# EAGLE design fonte-ajustavel (EAGLE 9.6.2)
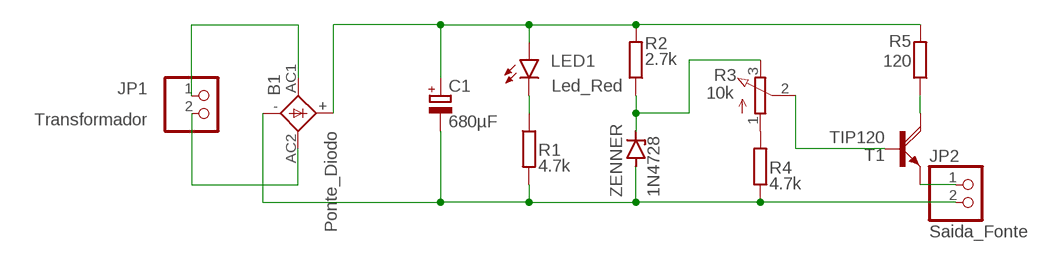
[diagram p0: schematic, sheet 1]

## Parts
B1  Ponte_Diodo  1KAB  [1KAB]
C1  680µF  CPOL-EUE5-10.5  [E5-10,5]
JP1  Transformador  PINHD-1X2  [1X02]
JP2  Saida_Fonte  PINHD-1X2  [1X02]
LED1  Led_Red  LED5MM  [LED5MM]
R1  4.7k  R-EU_0204/7  [0204/7]
R2  2.7k  R-EU_0204/7  [0204/7]
R3  10k  3RP/1610N  [3RP/1610N]
R4  4.7k  R-EU_0204/7  [0204/7]
R5  120  R-EU_0204/7  [0204/7]
T1  TIP120  [TO220AH]
ZENNER  1N4728  [DO41Z10]

## Nets
N$1: B1.AC1 JP1.1
N$2: B1.- C1.- JP2.2 R1.2 R4.1 ZENNER.A
N$3: B1.AC2 JP1.2
N$5: R3.1(A) R4.2
N$6: LED1.K(C) R1.1
N$7: R2.1 R3.3(E) ZENNER.C
N$8: JP2.1 T1.E
N$9: R5.1 T1.C
N$10: R3.2(S) T1.B
N$12: B1.+ C1.+ LED1.A R2.2 R5.2

## Library data of the parts
B1 = rectifier:1KAB: RECTIFIER grid 5,08 x 5,08 mm
C1 = rcl:CPOL-EU: POLARIZED CAPACITOR, European symbol; SPICEPREFIX: C
JP1 JP2 = pinhead:PINHD-1X2: PIN HEADER
LED1 = led:LED: LED OSRAM: - CHIPLED LG R971, LG N971, LY N971, LG Q971, LY Q971, LO R971, LY R971 LH N974, LH R974 LS Q976, LO Q976, LY Q976 LO Q996 - Hyper CHIPLED LW Q18S LB Q993, LB Q99A, LB R99A - SideLED LS A670, LO A670, LY A670, LG A670, LP A670 LB A673, LV A673, LT A673, LW A673 LH A674 LY A675 LS A676, LA A676, LO A676, LY A676, LW A676 LS A679, LY A679, LG A679 - Hyper Micro SIDELED® LS Y876, LA Y876, LO Y876, LY Y876 LT Y87S - SmartLED LW L88C, LW L88S LB L89C, LB L89S, LG L890 LS L89K, LO L89K, LY L89K LS L896, LA L896, LO L896, LY L896 - TOPLED LS T670, LO T670, LY T670, LG T670, LP T670 LSG T670, LSP T670, LSY T670, LOP T670, LYG T670 LG T671, LOG T671, LSG T671 LB T673, LV T673, LT T673, LW T673 LH T674 LS T676, LA T676, LO T676, LY T676, LB T676, LH T676, LSB T676, LW T676 LB T67C, LV T67C, LT T67C, LS T67K, LO T67K, LY T67K, LW E67C LS E67B, LA E67B, LO E67B, LY E67B, LB E67C, LV E67C, LT E67C LW T67C LS T679, LY T679, LG T679 LS T770, LO T770, LY T770, LG T770, LP T770 LB T773, LV T773, LT T773, LW T773 LH T774 LS E675, LA E675, LY E675, LS T675 LS T776, LA T776, LO T776, LY T776, LB T776 LHGB T686 LT T68C, LB T68C - Hyper Mini TOPLED® LB M676 - Mini TOPLED Santana® LG M470 LS M47K, LO M47K, LY M47K Source: http://www.osram.convergy.de LUXEON: - LUMILED® LXK2-PW12-R00, LXK2-PW12-S00, LXK2-PW14-U00, LXK2-PW14-V00 LXK2-PM12-R00, LXK2-PM12-S00, LXK2-PM14-U00 LXK2-PE12-Q00, LXK2-PE12-R00, LXK2-PE12-S00, LXK2-PE14-T00, LXK2-PE14-U00 LXK2-PB12-K00, LXK2-PB12-L00, LXK2-PB12-M00, LXK2-PB14-N00, LXK2-PB14-P00, LXK2-PB14-Q00 LXK2-PR12-L00, LXK2-PR12-M00, LXK2-PR14-Q00, LXK2-PR14-R00 LXK2-PD12-Q00, LXK2-PD12-R00, LXK2-PD12-S00 LXK2-PH12-R00, LXK2-PH12-S00 LXK2-PL12-P00, LXK2-PL12-Q00, LXK2-PL12-R00 Source: www.luxeon.com KINGBRIGHT: KA-3528ASYC Source: www.kingbright.com
R1 R2 R4 R5 = rcl:R-EU_: RESISTOR, European symbol; SPICEPREFIX: R
R3 = pot:3RP/1610N: 16mm Potentiometer one level Source: http://www.alphapotentiometers.net/html/16mm_pot_2.html
T1 = transistor-power:TIP120: NPN DARLINGTON TRANSISTOR
ZENNER = diode:1N4728: Z DIODE 3.3 V, 1W, 5 percent

## Board
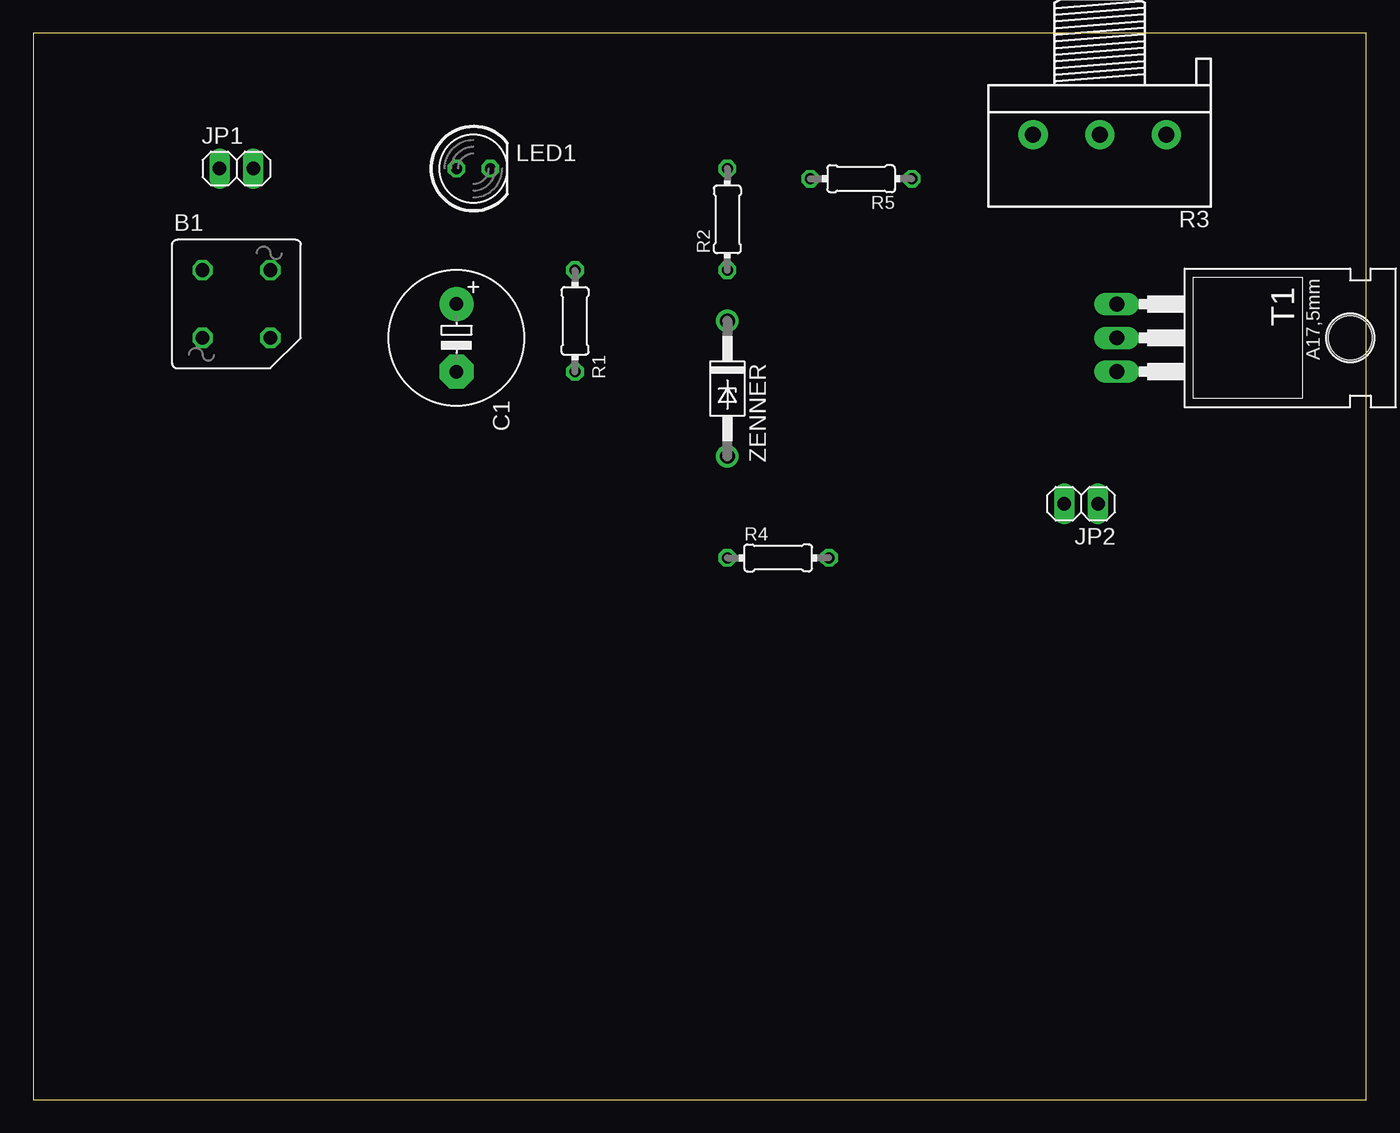
[diagram p1: board, top side]
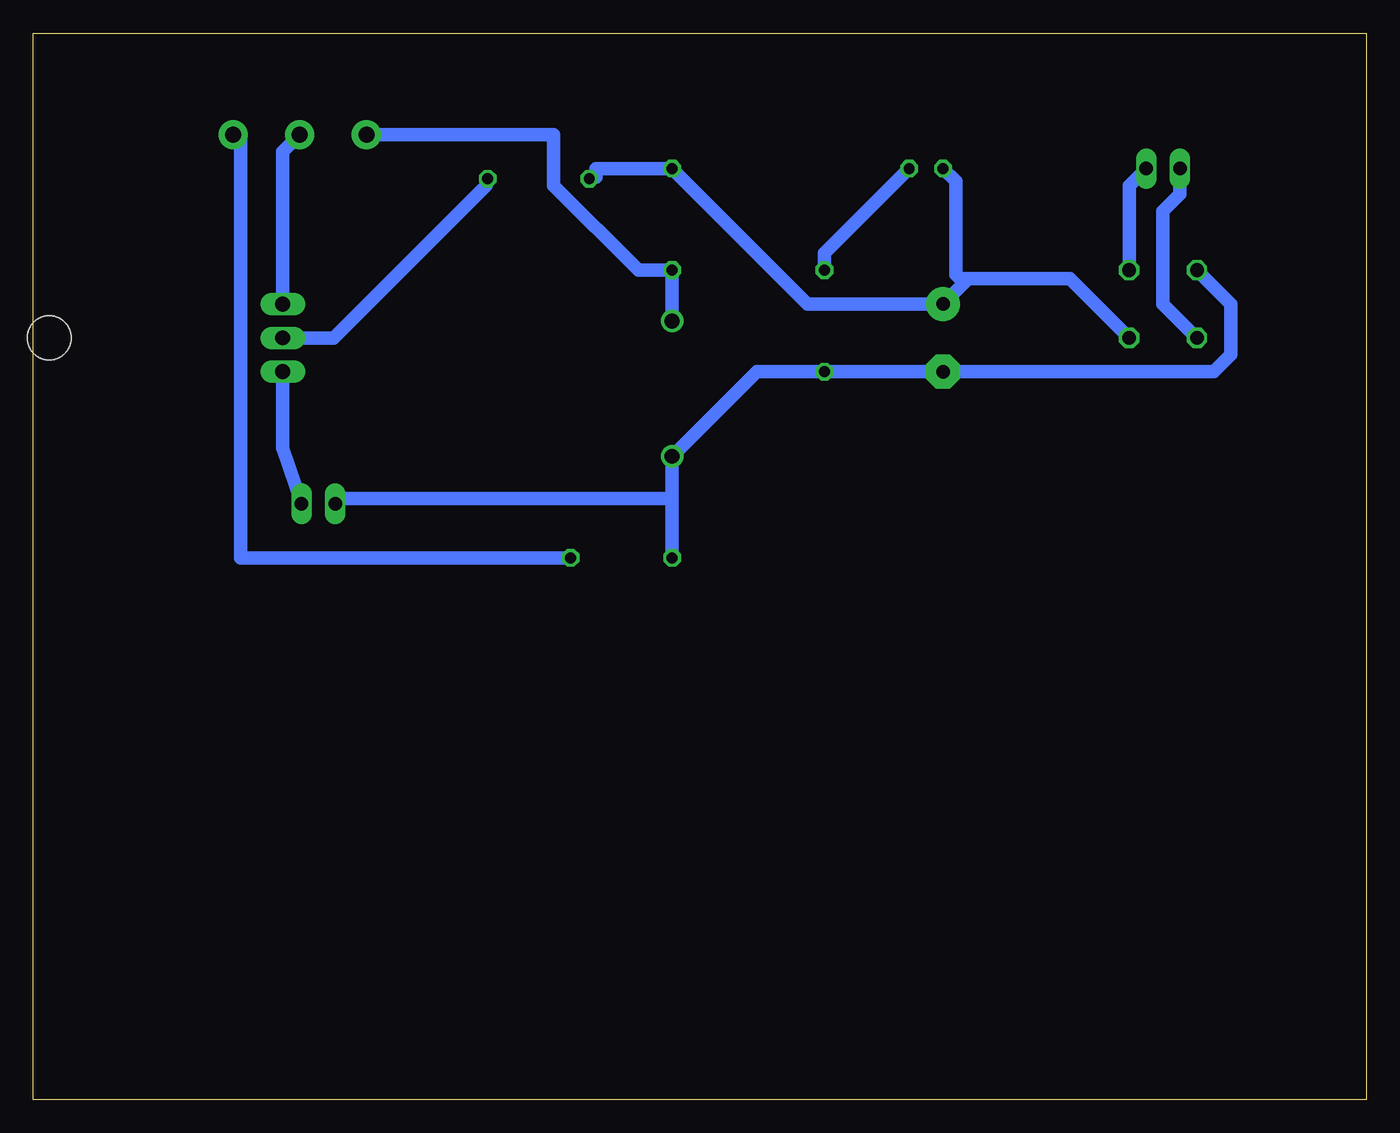
[diagram p2: board, bottom side, seen from below]

Size 100 x 80 mm. Coordinates in mm from the lower left corner, seen from the top.
Outline: 0,0 100,0 100,80 0,80 0,0
Copper layers (1*16): Top 0.035mm / dielectric 1.5mm / Bottom 0.035mm
Design rules "default *": minimum track width 40mil, minimum drill 0.35mm, track to track 40mil, track to pad 40mil, pad to pad 40mil, via to via 40mil, smd to smd 6mil, copper to edge 40mil, drill to drill 6mil, minimum pad ring 10mil, minimum via ring 8mil, stop-mask expansion 4mil, vias tented up to drill 0mil, thermal gap 10mil

### Footprints (pad centres in the part's own frame; a part is rotated, then mirrored left to right if it is on the bottom)
1KAB = drill 1.016 octagon: + 2.54,-2.54; - -2.54,2.54; AC1 -2.54,-2.54; AC2 2.54,2.54
E5-10,5 = drill 1.016 pad 2.54: + -2.54,0 | drill 1.016 pad 2.54 octagon: - 2.54,0
1X02 = drill 1.016 long: 1 -1.27,0; 2 1.27,0
LED5MM = drill 0.813 octagon: A -1.27,0; K 1.27,0
0204/7 = drill 0.813 octagon: 1 -3.81,0; 2 3.81,0
3RP/1610N = drill 1.2 pad 2.184: 1 -5,0; 2 0,0; 3 5,0
TO220AH = drill 1.118 long: B -2.54,-6.35; C 0,-6.35; E 2.54,-6.35 | hole 3.302: 0,11.176
DO41Z10 = drill 1.118: A 5.08,0; C -5.08,0

### Placement (x,y rotation side)
B1  15.24,59.69 0 top
C1  31.75,57.15 270 top
JP1  15.24,69.85 0 top
JP2  78.61,44.7 180 top
LED1  33.02,69.85 0 top
R1  40.64,58.42 270 top
R2  52.07,66.04 90 top
R3  80.01,72.39 180 top
R4  55.88,40.64 0 top
R5  62.1,69.09 180 top
T1  87.63,57.15 270 top
ZENNER  52.07,53.34 270 top

### Tracks (layer width: path | path; a pad name or v marks a point on that pad's centre or on a via)
N$1
  Bottom 1.016: B1.AC1 15.24,59.69 15.24,66.67 13.97,67.94 JP1.1
N$2
  Bottom 1.016: 52.07,45.09 ZENNER.A 45.72,54.61 R1.2 C1.- 11.43,54.61 10.16,55.88 10.16,59.69 B1.- | 52.07,45.09 R4.1 | 52.07,45.09 76.83,45.09 JP2.2
N$3
  Bottom 1.016: B1.AC2 17.78,68.58 JP1.2
N$5
  Bottom 1.016: R4.2 84.45,40.64 84.45,72.39 R3.1
N$6
  Bottom 1.016: R1.1 40.64,63.5 LED1.K
N$7
  Bottom 1.016: ZENNER.C R2.1 54.61,62.23 60.96,68.58 60.96,72.39 R3.3
N$8
  Bottom 1.016: T1.E 81.28,48.9 JP2.1
N$9
  Bottom 1.016: T1.C 77.47,57.15 66.04,68.58 R5.1
N$10
  Bottom 1.016: R3.2 81.28,71.12 T1.B
N$12
  Bottom 1.016: R5.2 57.78,69.22 57.78,69.85 R2.2 41.91,59.69 C1.+ 29.84,61.59 | LED1.A 30.8,68.9 30.8,61.91 30.48,61.59 29.84,61.59 | B1.+ 22.23,61.59 29.84,61.59